# EAGLE schematic panel (EAGLE 8.7.0)
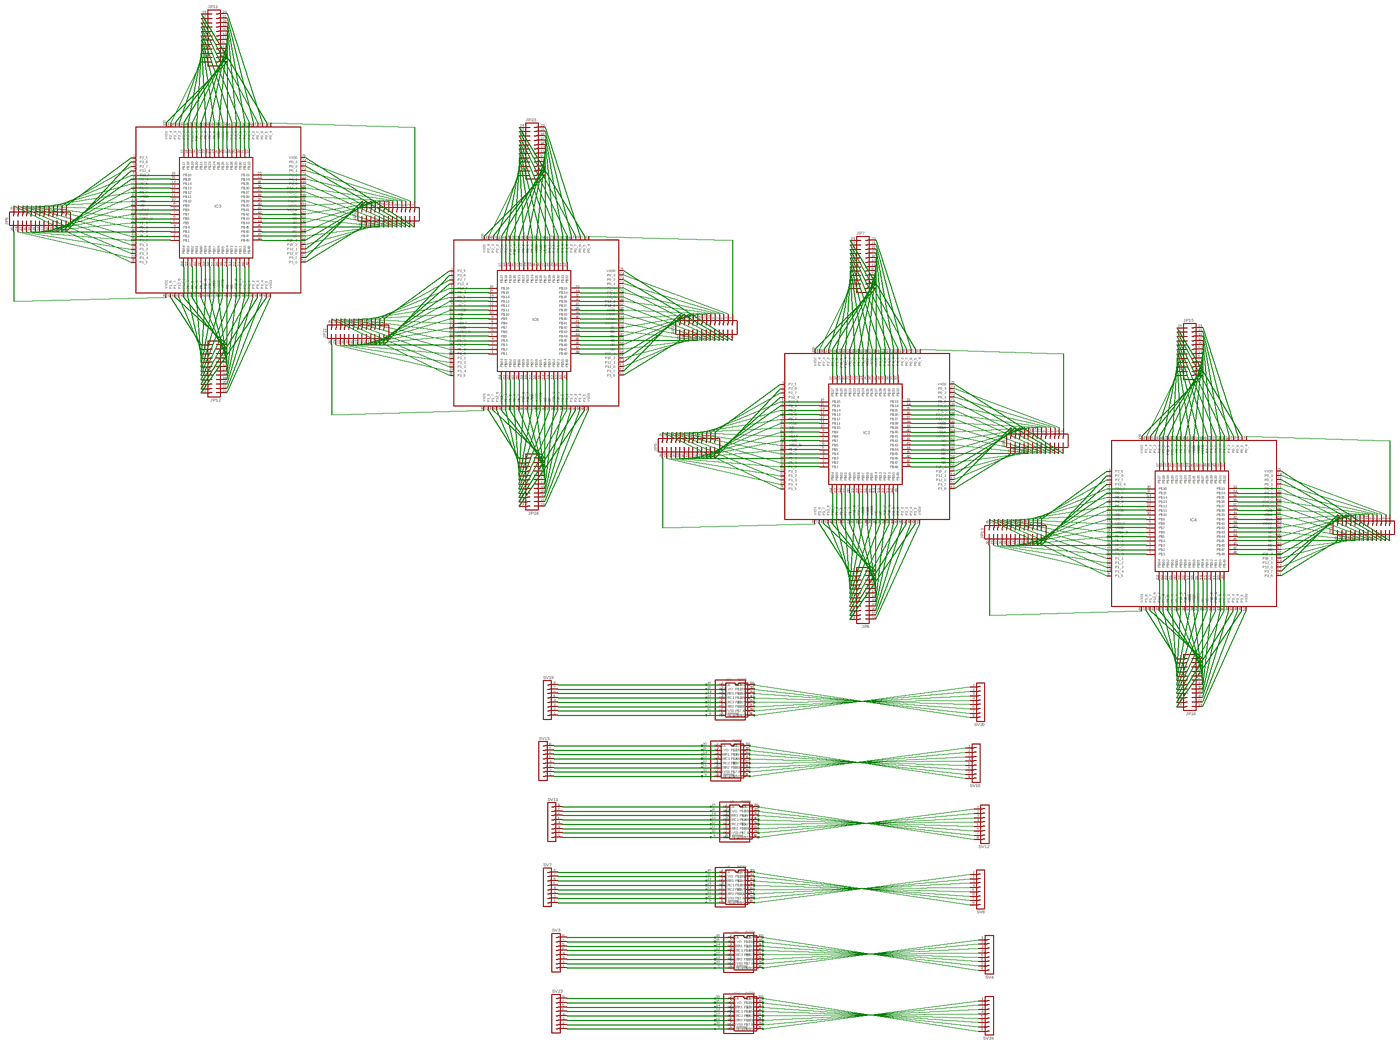
[diagram p0: schematic, sheet 1, overview]
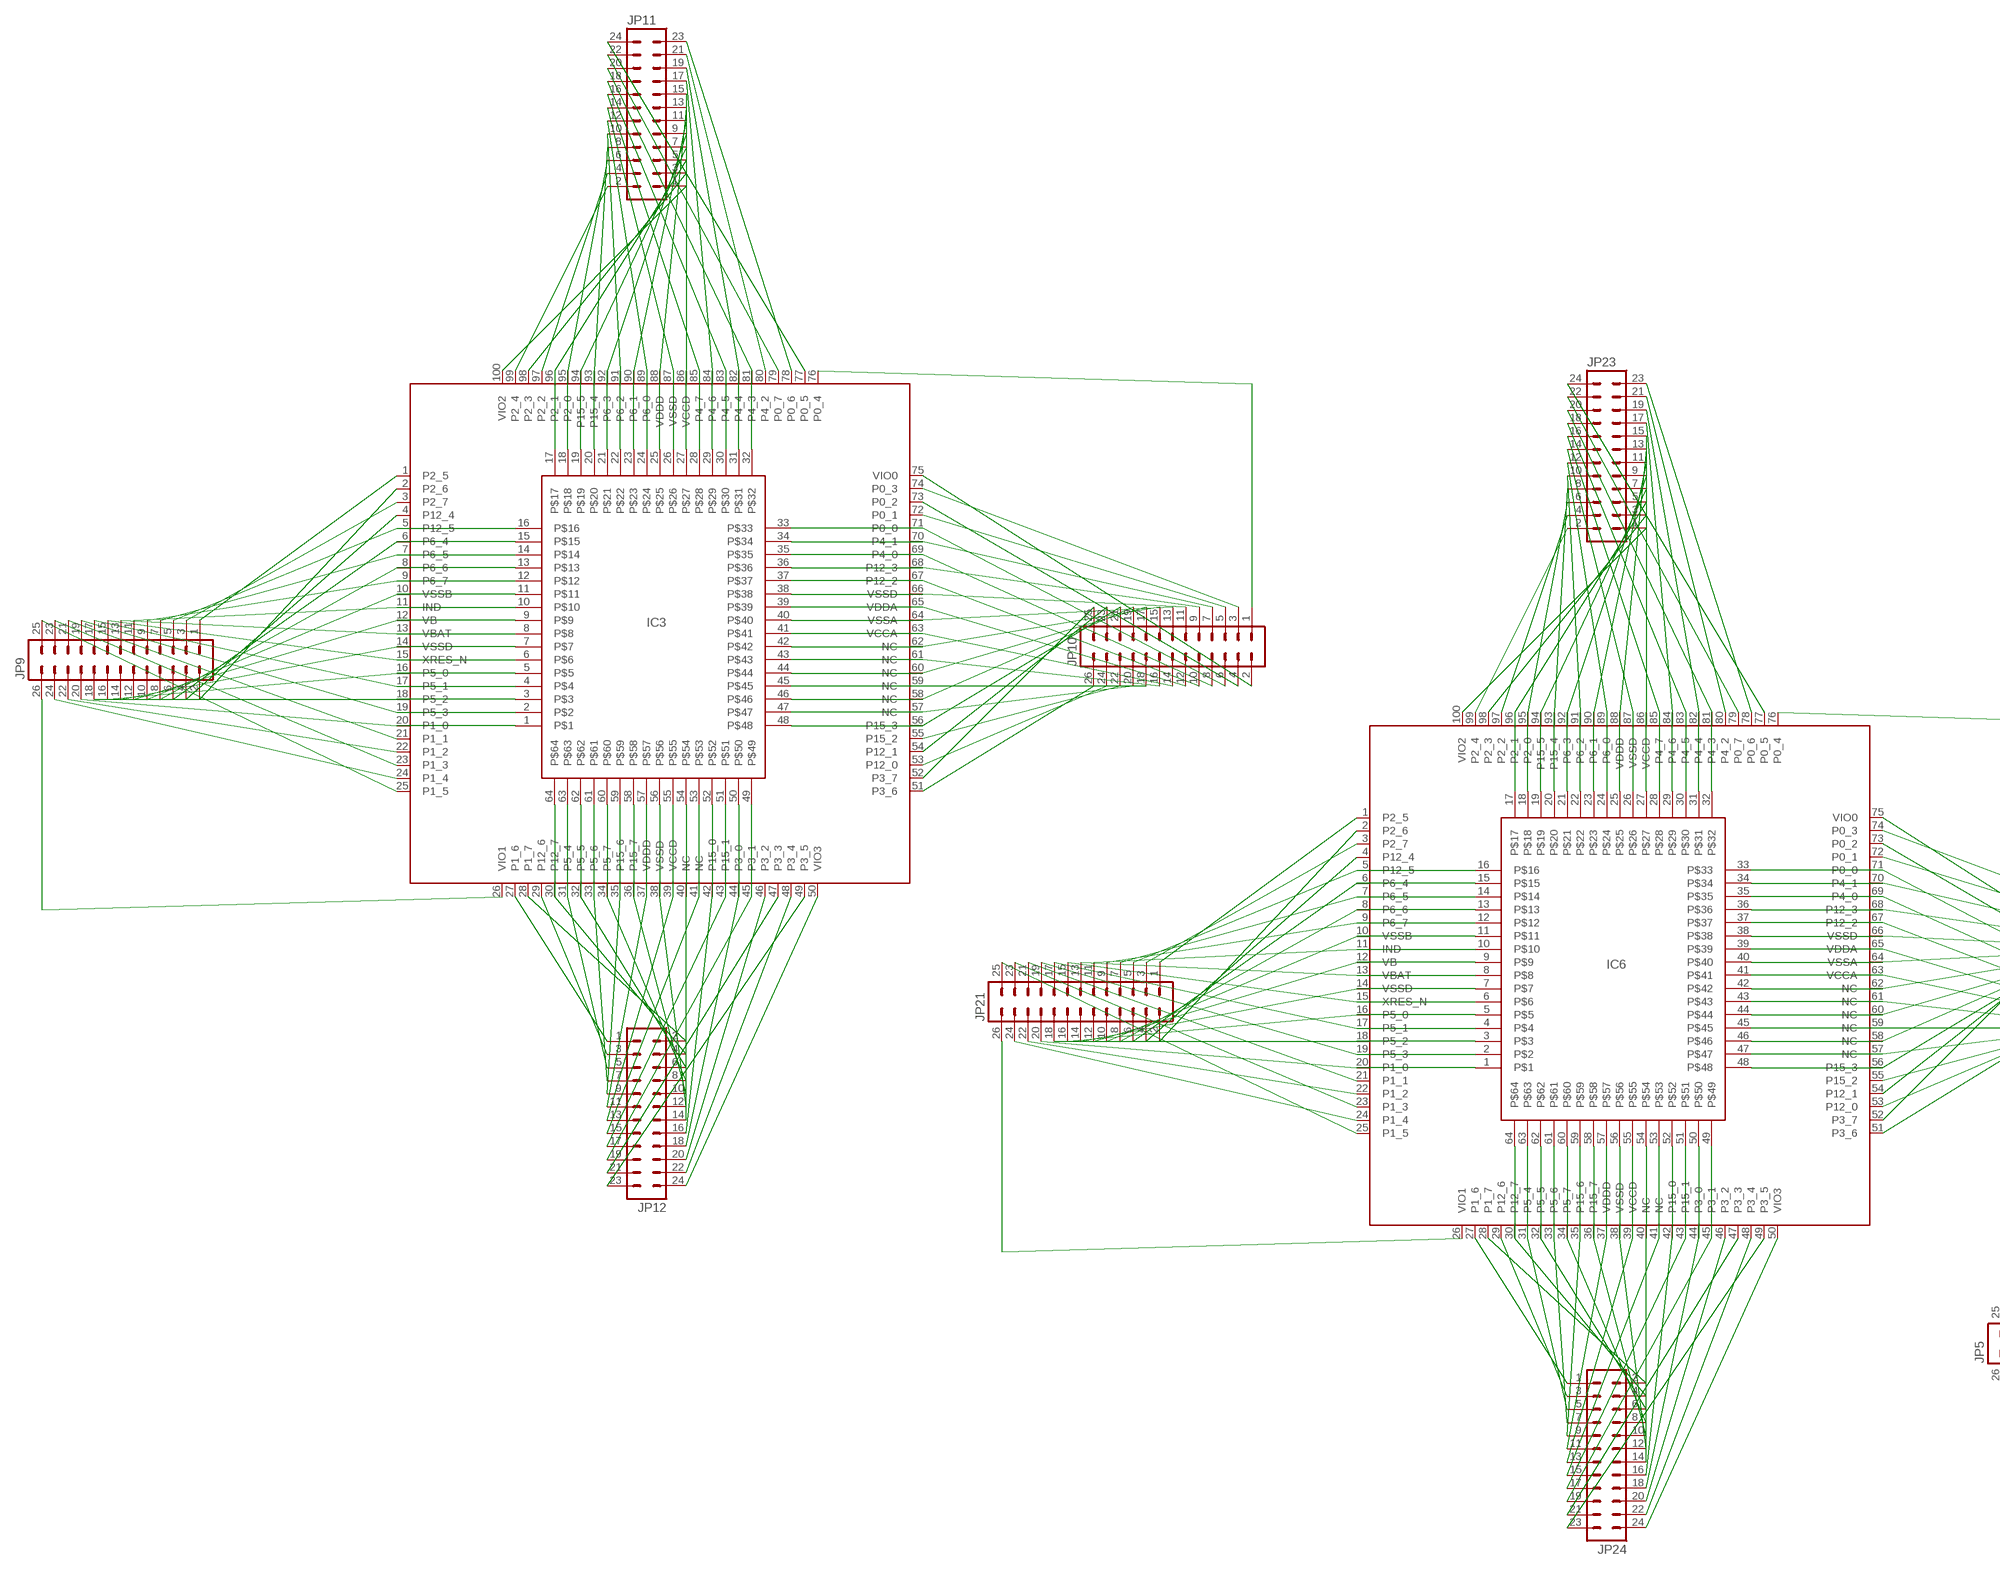
[diagram p1: schematic, sheet 1, part 1 of 4]
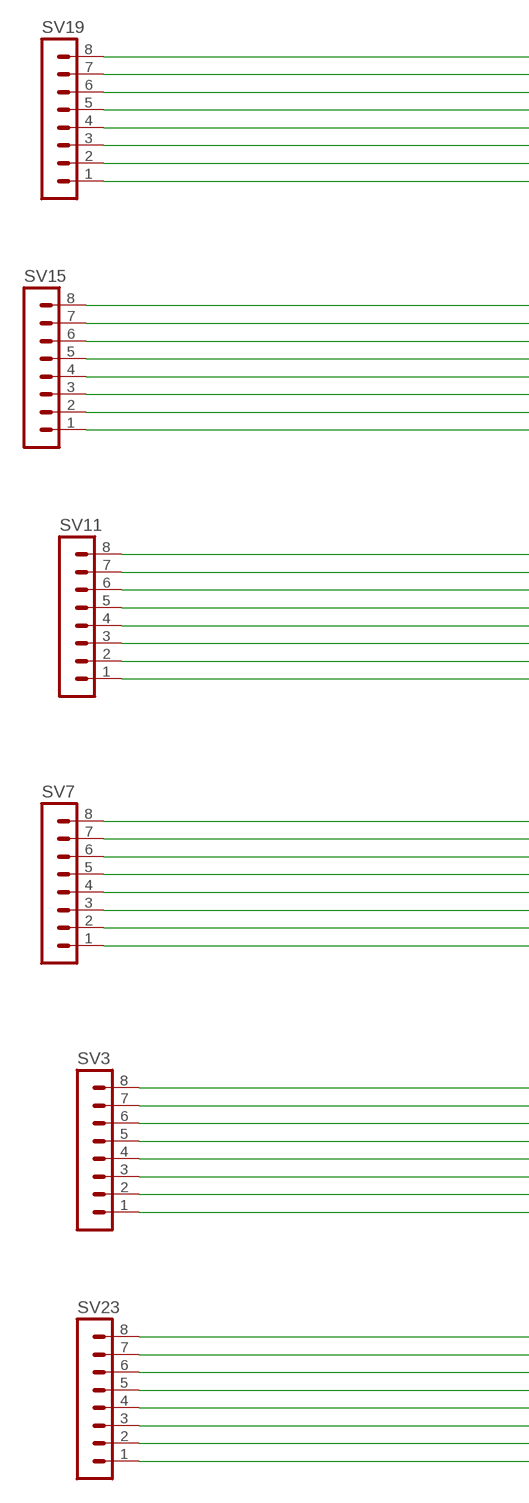
[diagram p2: schematic, sheet 1, part 2 of 4]
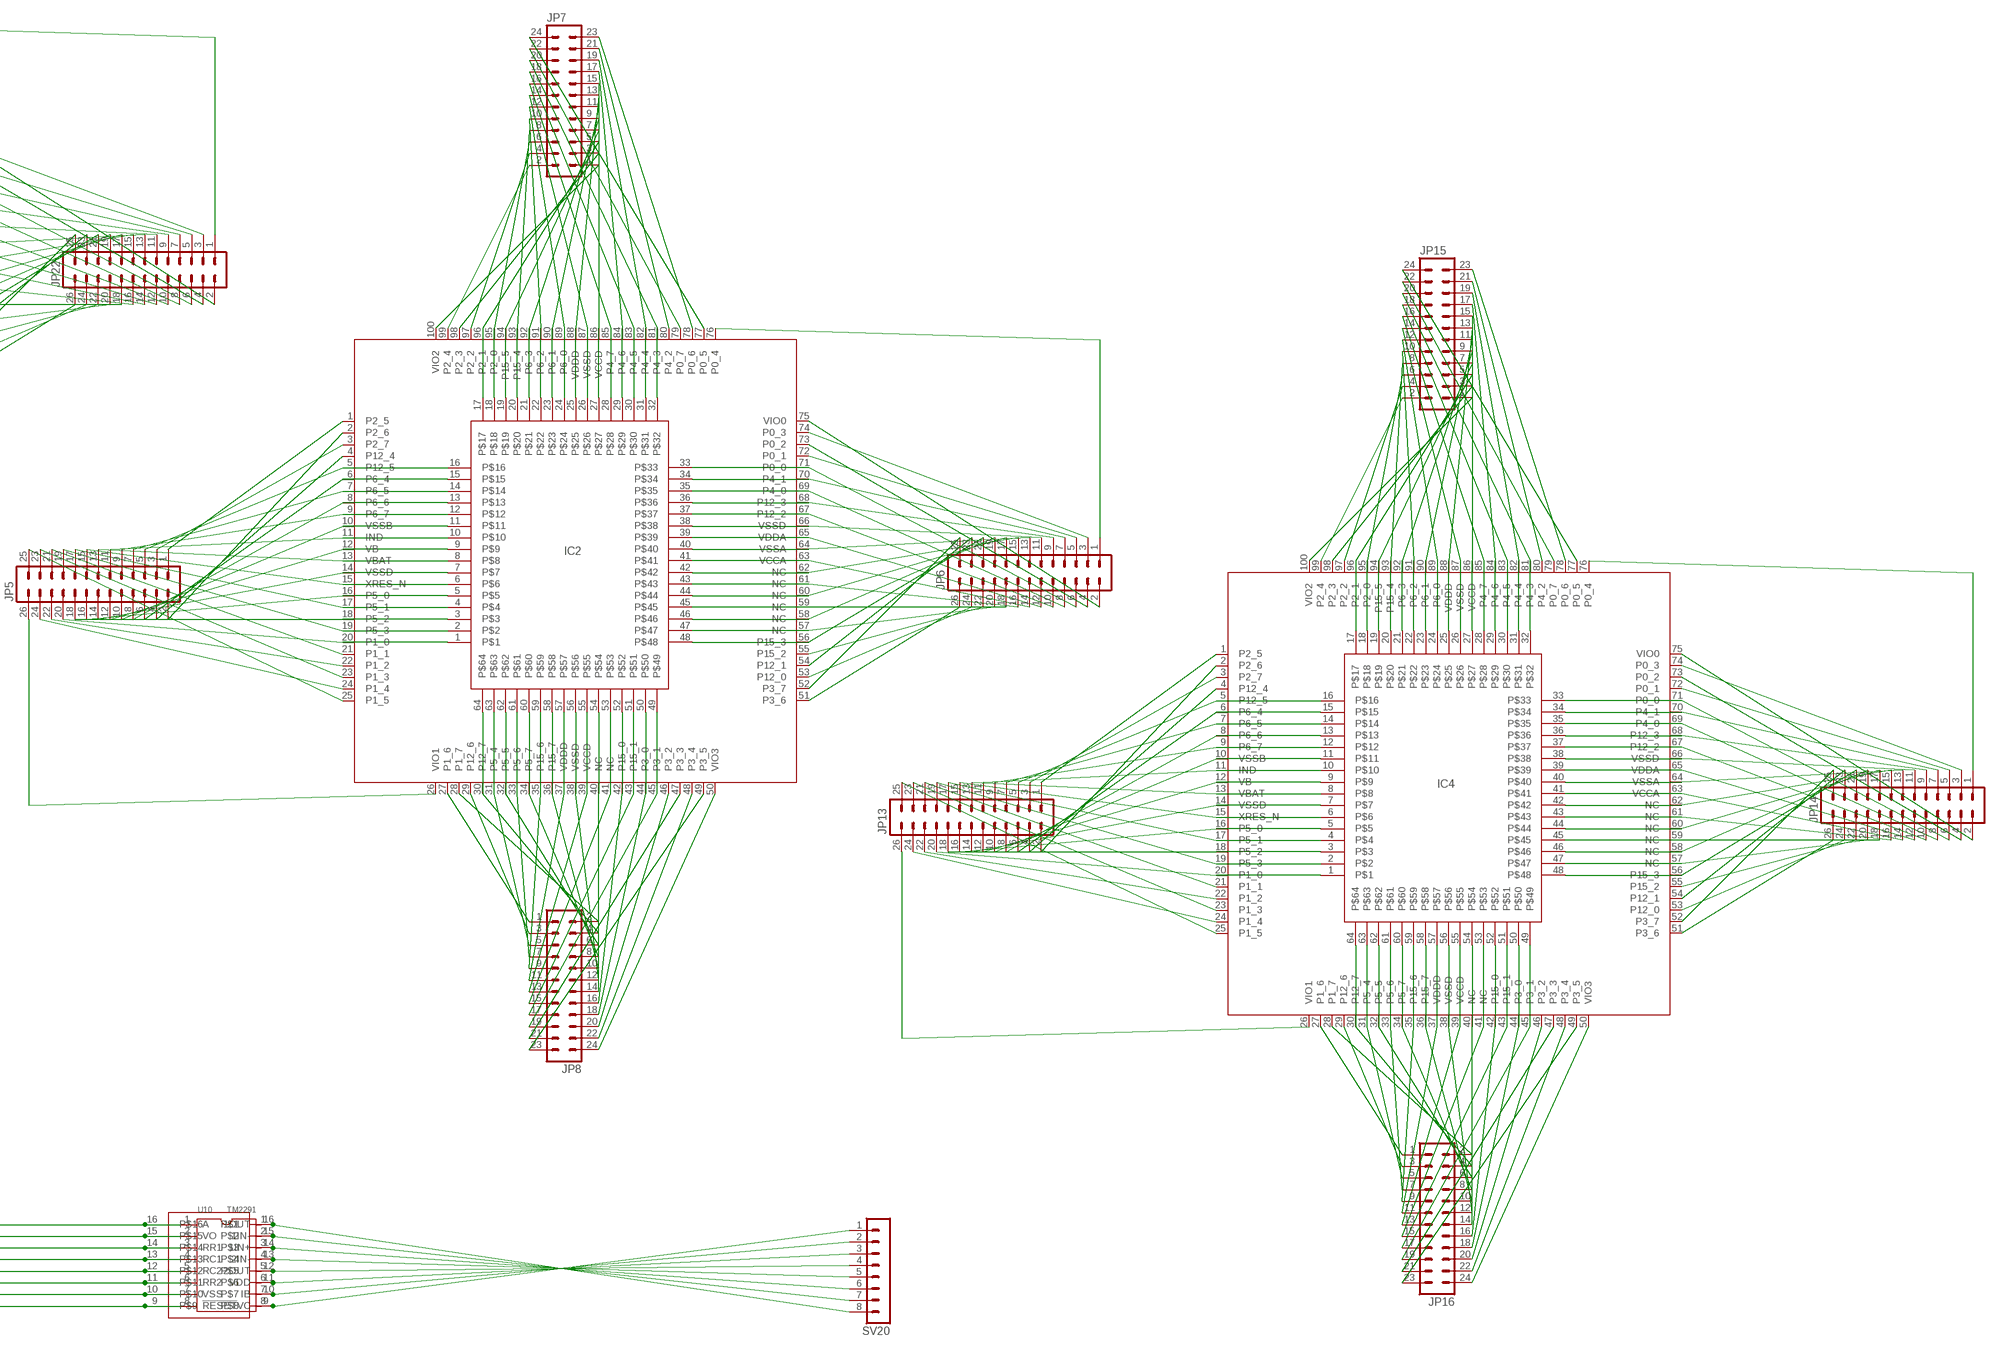
[diagram p3: schematic, sheet 1, part 3 of 4]
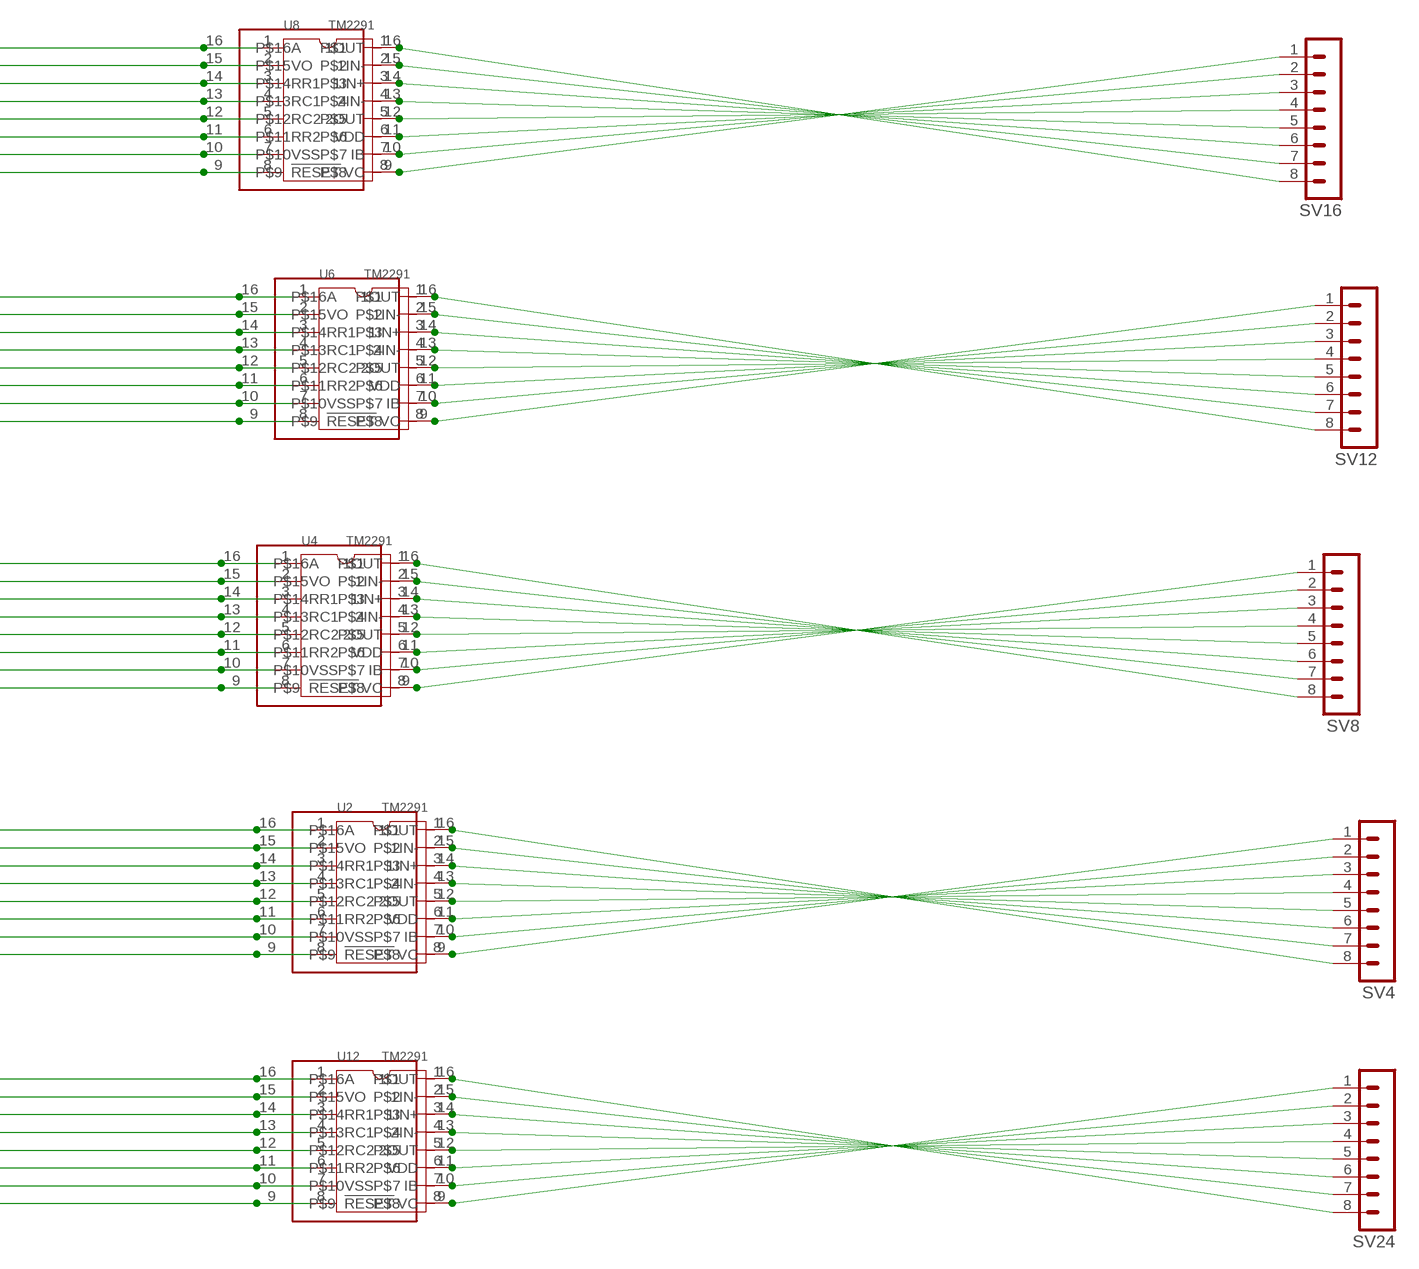
[diagram p4: schematic, sheet 1, part 4 of 4]

## Parts
IC2  CY8C58LPXXX  [TQFP100-14X14]
IC3  CY8C58LPXXX  [TQFP100-14X14]
IC4  CY8C58LPXXX  [TQFP100-14X14]
IC6  CY8C58LPXXX  [TQFP100-14X14]
JP5  MA13-2  [MA13-2]
JP6  MA13-2  [MA13-2]
JP7  MA12-2  [MA12-2]
JP8  MA12-2  [MA12-2]
JP9  MA13-2  [MA13-2]
JP10  MA13-2  [MA13-2]
JP11  MA12-2  [MA12-2]
JP12  MA12-2  [MA12-2]
JP13  MA13-2  [MA13-2]
JP14  MA13-2  [MA13-2]
JP15  MA12-2  [MA12-2]
JP16  MA12-2  [MA12-2]
JP21  MA13-2  [MA13-2]
JP22  MA13-2  [MA13-2]
JP23  MA12-2  [MA12-2]
JP24  MA12-2  [MA12-2]
SV3  MA08-1  [MA08-1]
SV4  MA08-1  [MA08-1]
SV7  MA08-1  [MA08-1]
SV8  MA08-1  [MA08-1]
SV11  MA08-1  [MA08-1]
SV12  MA08-1  [MA08-1]
SV15  MA08-1  [MA08-1]
SV16  MA08-1  [MA08-1]
SV19  MA08-1  [MA08-1]
SV20  MA08-1  [MA08-1]
SV23  MA08-1  [MA08-1]
SV24  MA08-1  [MA08-1]
U2  TM2291  OPTICAL-TM2291(SOP16-10X5MM)  [SOP16-1.27-10.0X5.0MM]
U4  TM2291  OPTICAL-TM2291(SOP16-10X5MM)  [SOP16-1.27-10.0X5.0MM]
U6  TM2291  OPTICAL-TM2291(SOP16-10X5MM)  [SOP16-1.27-10.0X5.0MM]
U8  TM2291  OPTICAL-TM2291(SOP16-10X5MM)  [SOP16-1.27-10.0X5.0MM]
U10  TM2291  OPTICAL-TM2291(SOP16-10X5MM)  [SOP16-1.27-10.0X5.0MM]
U12  TM2291  OPTICAL-TM2291(SOP16-10X5MM)  [SOP16-1.27-10.0X5.0MM]
U$2  TQFP64  [TQFP64-0.8]
U$3  TQFP64  [TQFP64-0.8]
U$4  TQFP64  [TQFP64-0.8]
U$6  TQFP64  [TQFP64-0.8]
U$7  SSOP16  [TSSOP16]
U$9  SSOP16  [TSSOP16]
U$11  SSOP16  [TSSOP16]
U$13  SSOP16  [TSSOP16]
U$15  SSOP16  [TSSOP16]
U$17  SSOP16  [TSSOP16]

## Nets
N$208: IC2.1(P2_5) JP5.1
N$209: IC2.2(P2_6) JP5.2
N$210: IC2.3(P2_7) JP5.3
N$211: IC2.4(P12_4) JP5.4
N$212: IC2.5(P12_5) JP5.5 U$2.16
N$213: IC2.6(P6_4) JP5.6 U$2.15
N$214: IC2.7(P6_5) JP5.7 U$2.14
N$215: IC2.8(P6_6) JP5.8 U$2.13
N$216: IC2.9(P6_7) JP5.9 U$2.12
N$217: IC2.10(VSSB) JP5.10 U$2.11
N$218: IC2.11(IND) JP5.11 U$2.10
N$219: IC2.12(VB) JP5.12 U$2.9
N$220: IC2.13(VBAT) JP5.13 U$2.8
N$221: IC2.25(P1_5) JP5.25
N$222: IC2.24(P1_4) JP5.24
N$223: IC2.23(P1_3) JP5.23
N$224: IC2.22(P1_2) JP5.22
N$225: IC2.21(P1_1) JP5.21
N$226: IC2.20(P1_0) JP5.20 U$2.1
N$227: IC2.19(P5_3) JP5.19 U$2.2
N$228: IC2.18(P5_2) JP5.18 U$2.3
N$229: IC2.17(P5_1) JP5.17 U$2.4
N$230: IC2.16(P5_0) JP5.16 U$2.5
N$231: IC2.15(XRES_N) JP5.15 U$2.6
N$232: IC2.14(VSSD) JP5.14 U$2.7
N$233: IC2.27(P1_6) JP8.1
N$234: IC2.28(P1_7) JP8.2
N$235: IC2.29(P12_6) JP8.3
N$236: IC2.30(P12_7) JP8.4 U$2.64
N$237: IC2.31(P5_4) JP8.5 U$2.63
N$238: IC2.32(P5_5) JP8.6 U$2.62
N$239: IC2.33(P5_6) JP8.7 U$2.61
N$240: IC2.34(P5_7) JP8.8 U$2.60
N$241: IC2.35(P15_6) JP8.9 U$2.59
N$242: IC2.36(P15_7) JP8.10 U$2.58
N$243: IC2.37(VDDD) JP8.11 U$2.57
N$244: IC2.38(VSSD) JP8.12 U$2.56
N$245: IC2.50(VIO3) JP8.24
N$246: IC2.49(P3_5) JP8.23
N$247: IC2.48(P3_4) JP8.22
N$248: IC2.47(P3_3) JP8.21
N$249: IC2.46(P3_2) JP8.20
N$250: IC2.45(P3_1) JP8.19 U$2.49
N$251: IC2.44(P3_0) JP8.18 U$2.50
N$252: IC2.43(P15_1) JP8.17 U$2.51
N$253: IC2.42(P15_0) JP8.16 U$2.52
N$254: IC2.41(NC) JP8.15 U$2.53
N$255: IC2.40(NC) JP8.14 U$2.54
N$256: IC2.39(VCCD) JP8.13 U$2.55
N$257: IC2.63(VCCA) JP6.14 U$2.41
N$258: IC2.62(NC) JP6.15 U$2.42
N$259: IC2.61(NC) JP6.16 U$2.43
N$260: IC2.60(NC) JP6.17 U$2.44
N$261: IC2.59(NC) JP6.18 U$2.45
N$262: IC2.58(NC) JP6.19 U$2.46
N$263: IC2.57(NC) JP6.20 U$2.47
N$264: IC2.56(P15_3) JP6.21 U$2.48
N$265: IC2.55(P15_2) JP6.22
N$266: IC2.54(P12_1) JP6.23
N$267: IC2.53(P12_0) JP6.24
N$268: IC2.52(P3_7) JP6.25
N$269: IC2.51(P3_6) JP6.26
N$270: IC2.64(VSSA) JP6.13 U$2.40
N$271: IC2.65(VDDA) JP6.12 U$2.39
N$272: IC2.66(VSSD) JP6.11 U$2.38
N$273: IC2.67(P12_2) JP6.10 U$2.37
N$274: IC2.68(P12_3) JP6.9 U$2.36
N$275: IC2.69(P4_0) JP6.8 U$2.35
N$276: IC2.70(P4_1) JP6.7 U$2.34
N$277: IC2.71(P0_0) JP6.6 U$2.33
N$278: IC2.72(P0_1) JP6.5
N$279: IC2.73(P0_2) JP6.4
N$280: IC2.74(P0_3) JP6.3
N$281: IC2.75(VIO0) JP6.2
N$282: IC2.100(VIO2) JP7.1
N$283: IC2.99(P2_4) JP7.2
N$284: IC2.98(P2_3) JP7.3
N$285: IC2.97(P2_2) JP7.4
N$286: IC2.96(P2_1) JP7.5 U$2.17
N$287: IC2.95(P2_0) JP7.6 U$2.18
N$288: IC2.94(P15_5) JP7.7 U$2.19
N$289: IC2.93(P15_4) JP7.8 U$2.20
N$290: IC2.92(P6_3) JP7.9 U$2.21
N$291: IC2.91(P6_2) JP7.10 U$2.22
N$292: IC2.90(P6_1) JP7.11 U$2.23
N$293: IC2.89(P6_0) JP7.12 U$2.24
N$294: IC2.77(P0_5) JP7.24
N$295: IC2.78(P0_6) JP7.23
N$296: IC2.79(P0_7) JP7.22
N$297: IC2.80(P4_2) JP7.21
N$298: IC2.81(P4_3) JP7.20 U$2.32
N$299: IC2.82(P4_4) JP7.19 U$2.31
N$300: IC2.83(P4_5) JP7.18 U$2.30
N$301: IC2.84(P4_6) JP7.17 U$2.29
N$302: IC2.85(P4_7) JP7.16 U$2.28
N$303: IC2.86(VCCD) JP7.15 U$2.27
N$304: IC2.87(VSSD) JP7.14 U$2.26
N$305: IC2.88(VDDD) JP7.13 U$2.25
N$306: IC2.76(P0_4) JP6.1
N$307: IC2.26(VIO1) JP5.26
N$415: IC3.1(P2_5) JP9.1
N$416: IC3.2(P2_6) JP9.2
N$417: IC3.3(P2_7) JP9.3
N$418: IC3.4(P12_4) JP9.4
N$419: IC3.5(P12_5) JP9.5 U$3.16
N$420: IC3.6(P6_4) JP9.6 U$3.15
N$421: IC3.7(P6_5) JP9.7 U$3.14
N$422: IC3.8(P6_6) JP9.8 U$3.13
N$423: IC3.9(P6_7) JP9.9 U$3.12
N$424: IC3.10(VSSB) JP9.10 U$3.11
N$425: IC3.11(IND) JP9.11 U$3.10
N$426: IC3.12(VB) JP9.12 U$3.9
N$427: IC3.13(VBAT) JP9.13 U$3.8
N$428: IC3.25(P1_5) JP9.25
N$429: IC3.24(P1_4) JP9.24
N$430: IC3.23(P1_3) JP9.23
N$431: IC3.22(P1_2) JP9.22
N$432: IC3.21(P1_1) JP9.21
N$433: IC3.20(P1_0) JP9.20 U$3.1
N$434: IC3.19(P5_3) JP9.19 U$3.2
N$435: IC3.18(P5_2) JP9.18 U$3.3
N$436: IC3.17(P5_1) JP9.17 U$3.4
N$437: IC3.16(P5_0) JP9.16 U$3.5
N$438: IC3.15(XRES_N) JP9.15 U$3.6
N$439: IC3.14(VSSD) JP9.14 U$3.7
N$440: IC3.27(P1_6) JP12.1
N$441: IC3.28(P1_7) JP12.2
N$442: IC3.29(P12_6) JP12.3
N$443: IC3.30(P12_7) JP12.4 U$3.64
N$444: IC3.31(P5_4) JP12.5 U$3.63
N$445: IC3.32(P5_5) JP12.6 U$3.62
N$446: IC3.33(P5_6) JP12.7 U$3.61
N$447: IC3.34(P5_7) JP12.8 U$3.60
N$448: IC3.35(P15_6) JP12.9 U$3.59
N$449: IC3.36(P15_7) JP12.10 U$3.58
N$450: IC3.37(VDDD) JP12.11 U$3.57
N$451: IC3.38(VSSD) JP12.12 U$3.56
N$452: IC3.50(VIO3) JP12.24
N$453: IC3.49(P3_5) JP12.23
N$454: IC3.48(P3_4) JP12.22
N$455: IC3.47(P3_3) JP12.21
N$456: IC3.46(P3_2) JP12.20
N$457: IC3.45(P3_1) JP12.19 U$3.49
N$458: IC3.44(P3_0) JP12.18 U$3.50
N$459: IC3.43(P15_1) JP12.17 U$3.51
N$460: IC3.42(P15_0) JP12.16 U$3.52
N$461: IC3.41(NC) JP12.15 U$3.53
N$462: IC3.40(NC) JP12.14 U$3.54
N$463: IC3.39(VCCD) JP12.13 U$3.55
N$464: IC3.63(VCCA) JP10.14 U$3.41
N$465: IC3.62(NC) JP10.15 U$3.42
N$466: IC3.61(NC) JP10.16 U$3.43
N$467: IC3.60(NC) JP10.17 U$3.44
N$468: IC3.59(NC) JP10.18 U$3.45
N$469: IC3.58(NC) JP10.19 U$3.46
N$470: IC3.57(NC) JP10.20 U$3.47
N$471: IC3.56(P15_3) JP10.21 U$3.48
N$472: IC3.55(P15_2) JP10.22
N$473: IC3.54(P12_1) JP10.23
N$474: IC3.53(P12_0) JP10.24
N$475: IC3.52(P3_7) JP10.25
N$476: IC3.51(P3_6) JP10.26
N$477: IC3.64(VSSA) JP10.13 U$3.40
N$478: IC3.65(VDDA) JP10.12 U$3.39
N$479: IC3.66(VSSD) JP10.11 U$3.38
N$480: IC3.67(P12_2) JP10.10 U$3.37
N$481: IC3.68(P12_3) JP10.9 U$3.36
N$482: IC3.69(P4_0) JP10.8 U$3.35
N$483: IC3.70(P4_1) JP10.7 U$3.34
N$484: IC3.71(P0_0) JP10.6 U$3.33
N$485: IC3.72(P0_1) JP10.5
N$486: IC3.73(P0_2) JP10.4
N$487: IC3.74(P0_3) JP10.3
N$488: IC3.75(VIO0) JP10.2
N$489: IC3.100(VIO2) JP11.1
N$490: IC3.99(P2_4) JP11.2
N$491: IC3.98(P2_3) JP11.3
N$492: IC3.97(P2_2) JP11.4
N$493: IC3.96(P2_1) JP11.5 U$3.17
N$494: IC3.95(P2_0) JP11.6 U$3.18
N$495: IC3.94(P15_5) JP11.7 U$3.19
N$496: IC3.93(P15_4) JP11.8 U$3.20
N$497: IC3.92(P6_3) JP11.9 U$3.21
N$498: IC3.91(P6_2) JP11.10 U$3.22
N$499: IC3.90(P6_1) JP11.11 U$3.23
N$500: IC3.89(P6_0) JP11.12 U$3.24
N$501: IC3.77(P0_5) JP11.24
N$502: IC3.78(P0_6) JP11.23
N$503: IC3.79(P0_7) JP11.22
N$504: IC3.80(P4_2) JP11.21
N$505: IC3.81(P4_3) JP11.20 U$3.32
N$506: IC3.82(P4_4) JP11.19 U$3.31
N$507: IC3.83(P4_5) JP11.18 U$3.30
N$508: IC3.84(P4_6) JP11.17 U$3.29
N$509: IC3.85(P4_7) JP11.16 U$3.28
N$510: IC3.86(VCCD) JP11.15 U$3.27
N$511: IC3.87(VSSD) JP11.14 U$3.26
N$512: IC3.88(VDDD) JP11.13 U$3.25
N$513: IC3.76(P0_4) JP10.1
N$514: IC3.26(VIO1) JP9.26
N$622: IC4.1(P2_5) JP13.1
N$623: IC4.2(P2_6) JP13.2
N$624: IC4.3(P2_7) JP13.3
N$625: IC4.4(P12_4) JP13.4
N$626: IC4.5(P12_5) JP13.5 U$4.16
N$627: IC4.6(P6_4) JP13.6 U$4.15
N$628: IC4.7(P6_5) JP13.7 U$4.14
N$629: IC4.8(P6_6) JP13.8 U$4.13
N$630: IC4.9(P6_7) JP13.9 U$4.12
N$631: IC4.10(VSSB) JP13.10 U$4.11
N$632: IC4.11(IND) JP13.11 U$4.10
N$633: IC4.12(VB) JP13.12 U$4.9
N$634: IC4.13(VBAT) JP13.13 U$4.8
N$635: IC4.25(P1_5) JP13.25
N$636: IC4.24(P1_4) JP13.24
N$637: IC4.23(P1_3) JP13.23
N$638: IC4.22(P1_2) JP13.22
N$639: IC4.21(P1_1) JP13.21
N$640: IC4.20(P1_0) JP13.20 U$4.1
N$641: IC4.19(P5_3) JP13.19 U$4.2
N$642: IC4.18(P5_2) JP13.18 U$4.3
N$643: IC4.17(P5_1) JP13.17 U$4.4
N$644: IC4.16(P5_0) JP13.16 U$4.5
N$645: IC4.15(XRES_N) JP13.15 U$4.6
N$646: IC4.14(VSSD) JP13.14 U$4.7
N$647: IC4.27(P1_6) JP16.1
N$648: IC4.28(P1_7) JP16.2
N$649: IC4.29(P12_6) JP16.3
N$650: IC4.30(P12_7) JP16.4 U$4.64
N$651: IC4.31(P5_4) JP16.5 U$4.63
N$652: IC4.32(P5_5) JP16.6 U$4.62
N$653: IC4.33(P5_6) JP16.7 U$4.61
N$654: IC4.34(P5_7) JP16.8 U$4.60
N$655: IC4.35(P15_6) JP16.9 U$4.59
N$656: IC4.36(P15_7) JP16.10 U$4.58
N$657: IC4.37(VDDD) JP16.11 U$4.57
N$658: IC4.38(VSSD) JP16.12 U$4.56
N$659: IC4.50(VIO3) JP16.24
N$660: IC4.49(P3_5) JP16.23
N$661: IC4.48(P3_4) JP16.22
N$662: IC4.47(P3_3) JP16.21
N$663: IC4.46(P3_2) JP16.20
N$664: IC4.45(P3_1) JP16.19 U$4.49
N$665: IC4.44(P3_0) JP16.18 U$4.50
N$666: IC4.43(P15_1) JP16.17 U$4.51
N$667: IC4.42(P15_0) JP16.16 U$4.52
N$668: IC4.41(NC) JP16.15 U$4.53
N$669: IC4.40(NC) JP16.14 U$4.54
N$670: IC4.39(VCCD) JP16.13 U$4.55
N$671: IC4.63(VCCA) JP14.14 U$4.41
N$672: IC4.62(NC) JP14.15 U$4.42
N$673: IC4.61(NC) JP14.16 U$4.43
N$674: IC4.60(NC) JP14.17 U$4.44
N$675: IC4.59(NC) JP14.18 U$4.45
N$676: IC4.58(NC) JP14.19 U$4.46
N$677: IC4.57(NC) JP14.20 U$4.47
N$678: IC4.56(P15_3) JP14.21 U$4.48
N$679: IC4.55(P15_2) JP14.22
N$680: IC4.54(P12_1) JP14.23
N$681: IC4.53(P12_0) JP14.24
N$682: IC4.52(P3_7) JP14.25
N$683: IC4.51(P3_6) JP14.26
N$684: IC4.64(VSSA) JP14.13 U$4.40
N$685: IC4.65(VDDA) JP14.12 U$4.39
N$686: IC4.66(VSSD) JP14.11 U$4.38
N$687: IC4.67(P12_2) JP14.10 U$4.37
N$688: IC4.68(P12_3) JP14.9 U$4.36
N$689: IC4.69(P4_0) JP14.8 U$4.35
N$690: IC4.70(P4_1) JP14.7 U$4.34
N$691: IC4.71(P0_0) JP14.6 U$4.33
N$692: IC4.72(P0_1) JP14.5
N$693: IC4.73(P0_2) JP14.4
N$694: IC4.74(P0_3) JP14.3
N$695: IC4.75(VIO0) JP14.2
N$696: IC4.100(VIO2) JP15.1
N$697: IC4.99(P2_4) JP15.2
N$698: IC4.98(P2_3) JP15.3
N$699: IC4.97(P2_2) JP15.4
N$700: IC4.96(P2_1) JP15.5 U$4.17
N$701: IC4.95(P2_0) JP15.6 U$4.18
N$702: IC4.94(P15_5) JP15.7 U$4.19
N$703: IC4.93(P15_4) JP15.8 U$4.20
N$704: IC4.92(P6_3) JP15.9 U$4.21
N$705: IC4.91(P6_2) JP15.10 U$4.22
N$706: IC4.90(P6_1) JP15.11 U$4.23
N$707: IC4.89(P6_0) JP15.12 U$4.24
N$708: IC4.77(P0_5) JP15.24
N$709: IC4.78(P0_6) JP15.23
N$710: IC4.79(P0_7) JP15.22
N$711: IC4.80(P4_2) JP15.21
N$712: IC4.81(P4_3) JP15.20 U$4.32
N$713: IC4.82(P4_4) JP15.19 U$4.31
N$714: IC4.83(P4_5) JP15.18 U$4.30
N$715: IC4.84(P4_6) JP15.17 U$4.29
N$716: IC4.85(P4_7) JP15.16 U$4.28
N$717: IC4.86(VCCD) JP15.15 U$4.27
N$718: IC4.87(VSSD) JP15.14 U$4.26
N$719: IC4.88(VDDD) JP15.13 U$4.25
N$720: IC4.76(P0_4) JP14.1
N$721: IC4.26(VIO1) JP13.26
N$844: SV3.1 U2.8(!RESET) U$7.9
N$845: SV3.8 U2.1(A) U$7.16
N$846: SV3.5 U2.4(RC1) U$7.13
N$847: SV3.4 U2.5(RC2) U$7.12
N$848: SV3.6 U2.3(RR1) U$7.14
N$849: SV3.3 U2.6(RR2) U$7.11
N$850: SV3.7 U2.2(VO) U$7.15
N$851: SV4.8 U2.16(1OUT) U$7.1
N$852: SV4.7 U2.15(1IN-) U$7.2
N$853: SV4.6 U2.14(1IN+) U$7.3
N$854: SV4.5 U2.13(2IN-) U$7.4
N$855: SV4.4 U2.12(2OUT) U$7.5
N$856: SV4.2 U2.10(IB) U$7.7
N$857: SV4.1 U2.9(VC) U$7.8
N$874: SV7.1 U4.8(!RESET) U$9.9
N$875: SV7.8 U4.1(A) U$9.16
N$876: SV7.5 U4.4(RC1) U$9.13
N$877: SV7.4 U4.5(RC2) U$9.12
N$878: SV7.6 U4.3(RR1) U$9.14
N$879: SV7.3 U4.6(RR2) U$9.11
N$880: SV7.7 U4.2(VO) U$9.15
N$881: SV8.8 U4.16(1OUT) U$9.1
N$882: SV8.7 U4.15(1IN-) U$9.2
N$883: SV8.6 U4.14(1IN+) U$9.3
N$884: SV8.5 U4.13(2IN-) U$9.4
N$885: SV8.4 U4.12(2OUT) U$9.5
N$886: SV8.2 U4.10(IB) U$9.7
N$887: SV8.1 U4.9(VC) U$9.8
N$904: SV11.1 U6.8(!RESET) U$11.9
N$905: SV11.8 U6.1(A) U$11.16
N$906: SV11.5 U6.4(RC1) U$11.13
N$907: SV11.4 U6.5(RC2) U$11.12
N$908: SV11.6 U6.3(RR1) U$11.14
N$909: SV11.3 U6.6(RR2) U$11.11
N$910: SV11.7 U6.2(VO) U$11.15
N$911: SV12.8 U6.16(1OUT) U$11.1
N$912: SV12.7 U6.15(1IN-) U$11.2
N$913: SV12.6 U6.14(1IN+) U$11.3
N$914: SV12.5 U6.13(2IN-) U$11.4
N$915: SV12.4 U6.12(2OUT) U$11.5
N$916: SV12.2 U6.10(IB) U$11.7
N$917: SV12.1 U6.9(VC) U$11.8
N$934: SV15.1 U8.8(!RESET) U$13.9
N$935: SV15.8 U8.1(A) U$13.16
N$936: SV15.5 U8.4(RC1) U$13.13
N$937: SV15.4 U8.5(RC2) U$13.12
N$938: SV15.6 U8.3(RR1) U$13.14
N$939: SV15.3 U8.6(RR2) U$13.11
N$940: SV15.7 U8.2(VO) U$13.15
N$941: SV16.8 U8.16(1OUT) U$13.1
N$942: SV16.7 U8.15(1IN-) U$13.2
N$943: SV16.6 U8.14(1IN+) U$13.3
N$944: SV16.5 U8.13(2IN-) U$13.4
N$945: SV16.4 U8.12(2OUT) U$13.5
N$946: SV16.2 U8.10(IB) U$13.7
N$947: SV16.1 U8.9(VC) U$13.8
N$964: SV19.1 U10.8(!RESET) U$15.9
N$965: SV19.8 U10.1(A) U$15.16
N$966: SV19.5 U10.4(RC1) U$15.13
N$967: SV19.4 U10.5(RC2) U$15.12
N$968: SV19.6 U10.3(RR1) U$15.14
N$969: SV19.3 U10.6(RR2) U$15.11
N$970: SV19.7 U10.2(VO) U$15.15
N$971: SV20.8 U10.16(1OUT) U$15.1
N$972: SV20.7 U10.15(1IN-) U$15.2
N$973: SV20.6 U10.14(1IN+) U$15.3
N$974: SV20.5 U10.13(2IN-) U$15.4
N$975: SV20.4 U10.12(2OUT) U$15.5
N$976: SV20.2 U10.10(IB) U$15.7
N$977: SV20.1 U10.9(VC) U$15.8
N$994: SV23.1 U12.8(!RESET) U$17.9
N$995: SV23.8 U12.1(A) U$17.16
N$996: SV23.5 U12.4(RC1) U$17.13
N$997: SV23.4 U12.5(RC2) U$17.12
N$998: SV23.6 U12.3(RR1) U$17.14
N$999: SV23.3 U12.6(RR2) U$17.11
N$1000: SV23.7 U12.2(VO) U$17.15
N$1001: SV24.8 U12.16(1OUT) U$17.1
N$1002: SV24.7 U12.15(1IN-) U$17.2
N$1003: SV24.6 U12.14(1IN+) U$17.3
N$1004: SV24.5 U12.13(2IN-) U$17.4
N$1005: SV24.4 U12.12(2OUT) U$17.5
N$1006: SV24.2 U12.10(IB) U$17.7
N$1007: SV24.1 U12.9(VC) U$17.8
N$1036: IC6.1(P2_5) JP21.1
N$1037: IC6.2(P2_6) JP21.2
N$1038: IC6.3(P2_7) JP21.3
N$1039: IC6.4(P12_4) JP21.4
N$1040: IC6.5(P12_5) JP21.5 U$6.16
N$1041: IC6.6(P6_4) JP21.6 U$6.15
N$1042: IC6.7(P6_5) JP21.7 U$6.14
N$1043: IC6.8(P6_6) JP21.8 U$6.13
N$1044: IC6.9(P6_7) JP21.9 U$6.12
N$1045: IC6.10(VSSB) JP21.10 U$6.11
N$1046: IC6.11(IND) JP21.11 U$6.10
N$1047: IC6.12(VB) JP21.12 U$6.9
N$1048: IC6.13(VBAT) JP21.13 U$6.8
N$1049: IC6.25(P1_5) JP21.25
N$1050: IC6.24(P1_4) JP21.24
N$1051: IC6.23(P1_3) JP21.23
N$1052: IC6.22(P1_2) JP21.22
N$1053: IC6.21(P1_1) JP21.21
N$1054: IC6.20(P1_0) JP21.20 U$6.1
N$1055: IC6.19(P5_3) JP21.19 U$6.2
N$1056: IC6.18(P5_2) JP21.18 U$6.3
N$1057: IC6.17(P5_1) JP21.17 U$6.4
N$1058: IC6.16(P5_0) JP21.16 U$6.5
N$1059: IC6.15(XRES_N) JP21.15 U$6.6
N$1060: IC6.14(VSSD) JP21.14 U$6.7
N$1061: IC6.27(P1_6) JP24.1
N$1062: IC6.28(P1_7) JP24.2
N$1063: IC6.29(P12_6) JP24.3
N$1064: IC6.30(P12_7) JP24.4 U$6.64
N$1065: IC6.31(P5_4) JP24.5 U$6.63
N$1066: IC6.32(P5_5) JP24.6 U$6.62
N$1067: IC6.33(P5_6) JP24.7 U$6.61
N$1068: IC6.34(P5_7) JP24.8 U$6.60
N$1069: IC6.35(P15_6) JP24.9 U$6.59
N$1070: IC6.36(P15_7) JP24.10 U$6.58
N$1071: IC6.37(VDDD) JP24.11 U$6.57
N$1072: IC6.38(VSSD) JP24.12 U$6.56
N$1073: IC6.50(VIO3) JP24.24
N$1074: IC6.49(P3_5) JP24.23
N$1075: IC6.48(P3_4) JP24.22
N$1076: IC6.47(P3_3) JP24.21
N$1077: IC6.46(P3_2) JP24.20
N$1078: IC6.45(P3_1) JP24.19 U$6.49
N$1079: IC6.44(P3_0) JP24.18 U$6.50
N$1080: IC6.43(P15_1) JP24.17 U$6.51
N$1081: IC6.42(P15_0) JP24.16 U$6.52
N$1082: IC6.41(NC) JP24.15 U$6.53
N$1083: IC6.40(NC) JP24.14 U$6.54
N$1084: IC6.39(VCCD) JP24.13 U$6.55
N$1085: IC6.63(VCCA) JP22.14 U$6.41
N$1086: IC6.62(NC) JP22.15 U$6.42
N$1087: IC6.61(NC) JP22.16 U$6.43
N$1088: IC6.60(NC) JP22.17 U$6.44
N$1089: IC6.59(NC) JP22.18 U$6.45
N$1090: IC6.58(NC) JP22.19 U$6.46
N$1091: IC6.57(NC) JP22.20 U$6.47
N$1092: IC6.56(P15_3) JP22.21 U$6.48
N$1093: IC6.55(P15_2) JP22.22
N$1094: IC6.54(P12_1) JP22.23
N$1095: IC6.53(P12_0) JP22.24
N$1096: IC6.52(P3_7) JP22.25
N$1097: IC6.51(P3_6) JP22.26
N$1098: IC6.64(VSSA) JP22.13 U$6.40
N$1099: IC6.65(VDDA) JP22.12 U$6.39
N$1100: IC6.66(VSSD) JP22.11 U$6.38
N$1101: IC6.67(P12_2) JP22.10 U$6.37
N$1102: IC6.68(P12_3) JP22.9 U$6.36
N$1103: IC6.69(P4_0) JP22.8 U$6.35
N$1104: IC6.70(P4_1) JP22.7 U$6.34
N$1105: IC6.71(P0_0) JP22.6 U$6.33
N$1106: IC6.72(P0_1) JP22.5
N$1107: IC6.73(P0_2) JP22.4
N$1108: IC6.74(P0_3) JP22.3
N$1109: IC6.75(VIO0) JP22.2
N$1110: IC6.100(VIO2) JP23.1
N$1111: IC6.99(P2_4) JP23.2
N$1112: IC6.98(P2_3) JP23.3
N$1113: IC6.97(P2_2) JP23.4
N$1114: IC6.96(P2_1) JP23.5 U$6.17
N$1115: IC6.95(P2_0) JP23.6 U$6.18
N$1116: IC6.94(P15_5) JP23.7 U$6.19
N$1117: IC6.93(P15_4) JP23.8 U$6.20
N$1118: IC6.92(P6_3) JP23.9 U$6.21
N$1119: IC6.91(P6_2) JP23.10 U$6.22
N$1120: IC6.90(P6_1) JP23.11 U$6.23
N$1121: IC6.89(P6_0) JP23.12 U$6.24
N$1122: IC6.77(P0_5) JP23.24
N$1123: IC6.78(P0_6) JP23.23
N$1124: IC6.79(P0_7) JP23.22
N$1125: IC6.80(P4_2) JP23.21
N$1126: IC6.81(P4_3) JP23.20 U$6.32
N$1127: IC6.82(P4_4) JP23.19 U$6.31
N$1128: IC6.83(P4_5) JP23.18 U$6.30
N$1129: IC6.84(P4_6) JP23.17 U$6.29
N$1130: IC6.85(P4_7) JP23.16 U$6.28
N$1131: IC6.86(VCCD) JP23.15 U$6.27
N$1132: IC6.87(VSSD) JP23.14 U$6.26
N$1133: IC6.88(VDDD) JP23.13 U$6.25
N$1134: IC6.76(P0_4) JP22.1
N$1135: IC6.26(VIO1) JP21.26
VDD: SV4.3 SV8.3 SV12.3 SV16.3 SV20.3 SV24.3 U2.11(VDD) U4.11(VDD) U6.11(VDD) U8.11(VDD) U10.11(VDD) U12.11(VDD) U$7.6 U$9.6 U$11.6 U$13.6 U$15.6 U$17.6
VSS: SV3.2 SV7.2 SV11.2 SV15.2 SV19.2 SV23.2 U2.7(VSS) U4.7(VSS) U6.7(VSS) U8.7(VSS) U10.7(VSS) U12.7(VSS) U$7.10 U$9.10 U$11.10 U$13.10 U$15.10 U$17.10

## Library data of the parts
IC2-IC4 IC6 = cypress:CY8C58LPXXX: CY8C58LPXXX_TQFP100_4JTAG edit this description Auto generated by make-symbol-device-package-bsdl.ulp Rev. 43 Source: CY8C58LPXXX_TQFP100_4JTAG.bsdl
JP5 JP6 JP9 JP10 JP13 JP14 JP21 JP22 = con-lstb:MA13-2: PIN HEADER; OC_FARNELL: unknown; OC_NEWARK: unknown
JP7 JP8 JP11 JP12 JP15 JP16 JP23 JP24 = con-lstb:MA12-2: PIN HEADER; OC_FARNELL: unknown; OC_NEWARK: unknown
SV3 SV4 SV7 SV8 SV11 SV12 SV15 SV16 SV19 SV20 SV23 SV24 = con-lstb:MA08-1: PIN HEADER; OC_FARNELL: unknown; OC_NEWARK: unknown
U2 U4 U6 U8 U10 U12 = Seeed-Sensor:OPTICAL-TM2291(SOP16-10X5MM): 314020020; MPN: TM2291
U$2-U$4 U$6 = 7_segment_lib:TQFP64
U$7 U$9 U$11 U$13 U$15 U$17 = 7_segment_lib:SSOP16